# EAGLE design superbot-r1 (EAGLE 5.12)

## Sheet 1 of 2
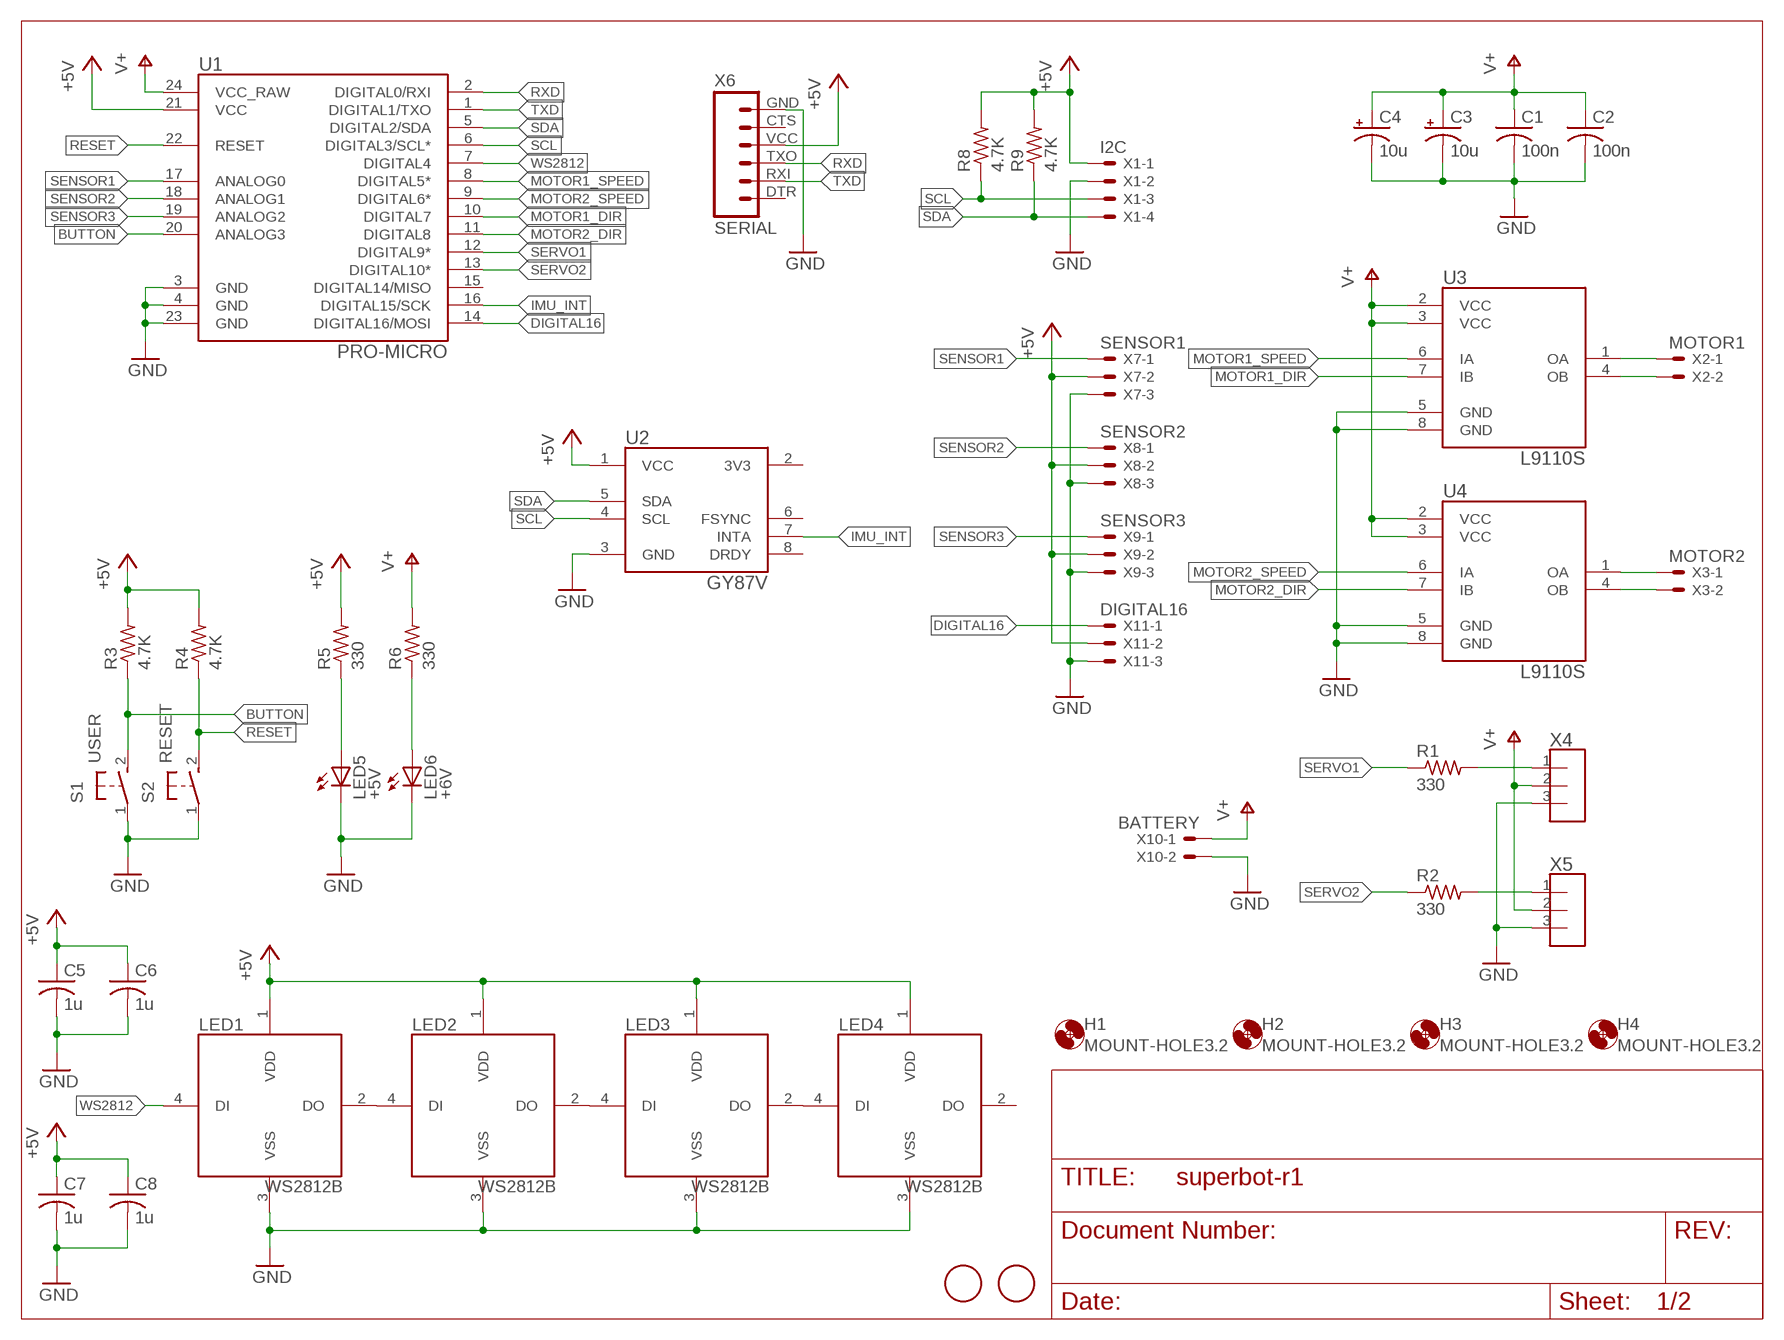
[diagram p0: schematic, sheet 1]

### Parts
C1  100n  C-USC0603  [C0603]
C2  100n  C-USC0603  [C0603]
C3  10u  CPOL-USB  [PANASONIC_B]
C4  10u  CPOL-USB  [PANASONIC_B]
C5  1u  C-USC0603  [C0603]
C6  1u  C-USC0603  [C0603]
C7  1u  C-USC0603  [C0603]
C8  1u  C-USC0603  [C0603]
H1  MOUNT-HOLE3.2  [3,2]
H2  MOUNT-HOLE3.2  [3,2]
H3  MOUNT-HOLE3.2  [3,2]
H4  MOUNT-HOLE3.2  [3,2]
LED1  WS2812B  [LED-TRICOLOR-5050-4PIN]
LED2  WS2812B  [LED-TRICOLOR-5050-4PIN]
LED3  WS2812B  [LED-TRICOLOR-5050-4PIN]
LED4  WS2812B  [LED-TRICOLOR-5050-4PIN]
LED5  +5V  LEDCHIP-LED0603  [CHIP-LED0603]
LED6  +6V  LEDCHIP-LED0603  [CHIP-LED0603]
R1  330  R-US_R0603  [R0603]
R2  330  R-US_R0603  [R0603]
R3  4.7K  R-US_R0603  [R0603]
R4  4.7K  R-US_R0603  [R0603]
R5  330  R-US_R0603  [R0603]
R6  330  R-US_R0603  [R0603]
R8  4.7K  R-US_R0603  [R0603]
R9  4.7K  R-US_R0603  [R0603]
S1  USER  TACT-SPSTSMD-6X3.6  [6X3.6-SPST]
S2  RESET  TACT-SPSTSMD-6X3.6  [6X3.6-SPST]
U1  PRO-MICRO  [PRO-MICRO]
U2  GY87V  [GY87-V]
U3  L9110S  [SO08]
U4  L9110S  [SO08]
U$3  FIDUCIAL  [FIDUCIAL_1MM]
U$4  FIDUCIAL  [FIDUCIAL_1MM]
X1  I2C  22-23-2041  [22-23-2041]
X2  MOTOR1  22-23-2021  [22-23-2021]
X3  MOTOR2  22-23-2021  [22-23-2021]
X4  M03-100MIL  [100MIL-3]
X5  M03-100MIL  [100MIL-3]
X6  SERIAL  FTDI_BASICPTH  [FTDI_BASIC]
X7  SENSOR1  22-23-2031  [22-23-2031]
X8  SENSOR2  22-23-2031  [22-23-2031]
X9  SENSOR3  22-23-2031  [22-23-2031]
X10  BATTERY  22-23-2021  [22-23-2021]
X11  DIGITAL16  22-23-2031  [22-23-2031]

### Nets
+5V: C5.1 C6.1 C7.1 C8.1 LED1.1(VDD) LED2.1(VDD) LED3.1(VDD) LED4.1(VDD) R3.2 R4.2 R5.2 R8.2 R9.2 U1.21(VCC) U2.1(VCC) X1.1 X6.VCC X7.2 X8.2 X9.2 X11.2 ; also sheet 2
BUTTON: R3.1 S1.2(S) U1.20(ANALOG3)
DIGITAL16: U1.14(DIGITAL16/MOSI) X11.1
GND: C1.2 C2.2 C3.- C4.- C5.2 C6.2 C7.2 C8.2 LED1.3(VSS) LED2.3(VSS) LED3.3(VSS) LED4.3(VSS) LED5.C LED6.C S1.1(P) S2.1(P) U1.3(GND) U1.4(GND) U1.23(GND) U2.3(GND) U3.5(GND) U3.8(GND) U4.5(GND) U4.8(GND) X1.2 X4.3 X5.3 X6.GND X7.3 X8.3 X9.3 X10.2 X11.3 ; also sheet 2
IMU_INT: U1.16(DIGITAL15/SCK) U2.7(INTA)
MOTOR1_DIR: U1.10(DIGITAL7) U3.7(IB)
MOTOR1_SPEED: U1.8(DIGITAL5*) U3.6(IA)
MOTOR2_DIR: U1.11(DIGITAL8) U4.7(IB)
MOTOR2_SPEED: U1.9(DIGITAL6*) U4.6(IA)
N$1: R1.2 X4.1
N$2: U3.1(OA) X2.1
N$3: U3.4(OB) X2.2
N$4: U4.4(OB) X3.2
N$5: U4.1(OA) X3.1
N$6: R2.2 X5.1
N$7: LED1.2(DO) LED2.4(DI)
N$8: LED2.2(DO) LED3.4(DI)
N$9: LED3.2(DO) LED4.4(DI)
N$10: LED5.A R5.1
N$11: LED6.A R6.1
RESET: R4.1 S2.2(S) U1.22(RESET)
RXD: U1.2(DIGITAL0/RXI) X6.TXO
SCL: R8.1 U1.6(DIGITAL3/SCL*) U2.4(SCL) X1.3
SDA: R9.1 U1.5(DIGITAL2/SDA) U2.5(SDA) X1.4
SENSOR1: U1.17(ANALOG0) X7.1
SENSOR2: U1.18(ANALOG1) X8.1
SENSOR3: U1.19(ANALOG2) X9.1
SERVO1: R1.1 U1.12(DIGITAL9*)
SERVO2: R2.1 U1.13(DIGITAL10*)
TXD: U1.1(DIGITAL1/TXO) X6.RXI
V+: C1.1 C2.1 C3.+ C4.+ R6.2 U1.24(VCC_RAW) U3.2(VCC) U3.3(VCC) U4.2(VCC) U4.3(VCC) X4.2 X5.2 X10.1
WS2812: LED1.4(DI) U1.7(DIGITAL4)
Unconnected: LED4.2(DO) U1.15(DIGITAL14/MISO) U2.2(3V3) U2.6(FSYNC) U2.8(DRDY) X6.CTS X6.DTR

## Sheet 2 of 2
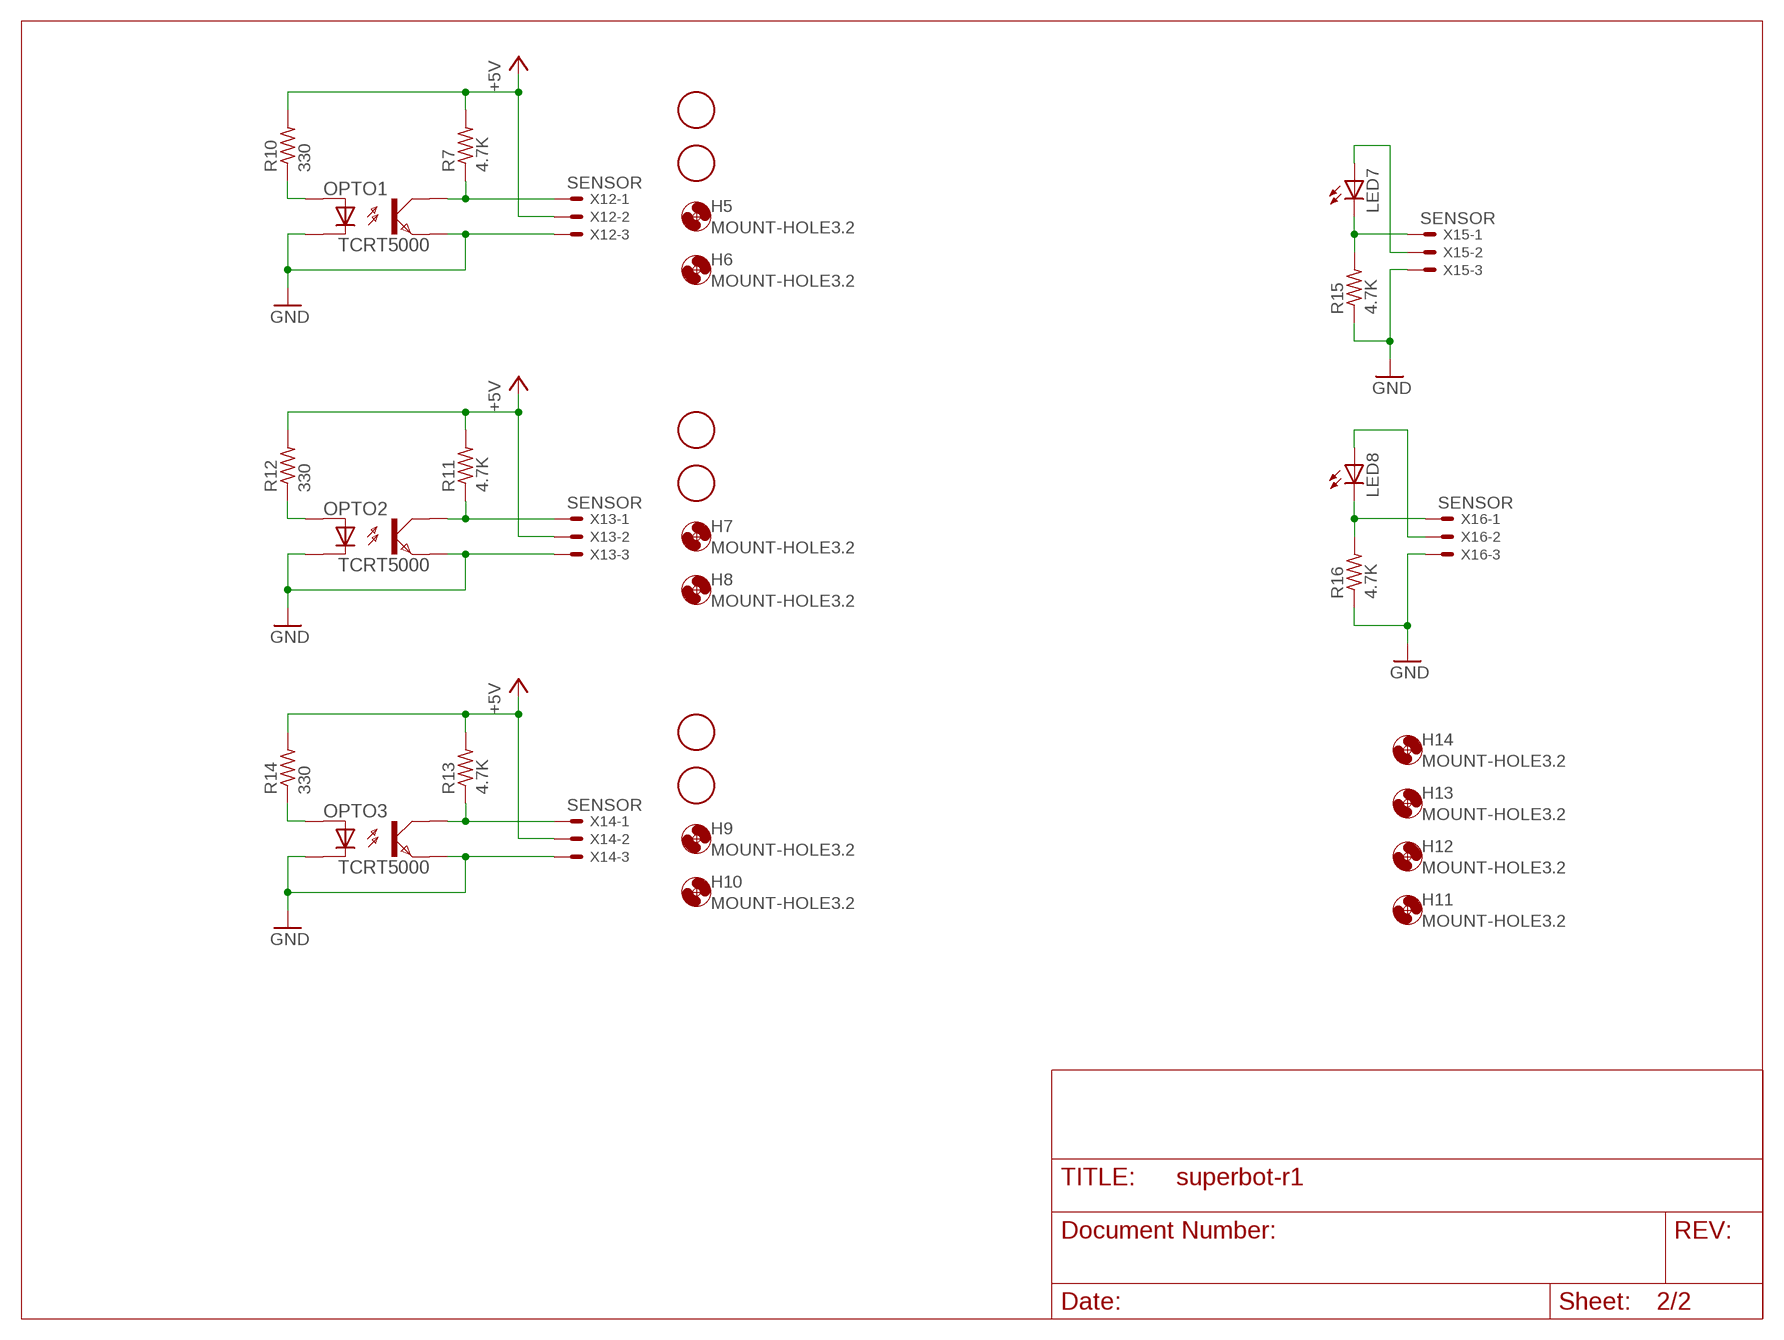
[diagram p1: schematic, sheet 2]

### Parts
H5  MOUNT-HOLE3.2  [3,2]
H6  MOUNT-HOLE3.2  [3,2]
H7  MOUNT-HOLE3.2  [3,2]
H8  MOUNT-HOLE3.2  [3,2]
H9  MOUNT-HOLE3.2  [3,2]
H10  MOUNT-HOLE3.2  [3,2]
H11  MOUNT-HOLE3.2  [3,2]
H12  MOUNT-HOLE3.2  [3,2]
H13  MOUNT-HOLE3.2  [3,2]
H14  MOUNT-HOLE3.2  [3,2]
LED7  LED3MM  [LED3MM]
LED8  LED3MM  [LED3MM]
OPTO1  TCRT5000  [TCRT5000]
OPTO2  TCRT5000  [TCRT5000]
OPTO3  TCRT5000  [TCRT5000]
R7  4.7K  R-US_R0603  [R0603]
R10  330  R-US_R0603  [R0603]
R11  4.7K  R-US_R0603  [R0603]
R12  330  R-US_R0603  [R0603]
R13  4.7K  R-US_R0603  [R0603]
R14  330  R-US_R0603  [R0603]
R15  4.7K  R-US_R0603  [R0603]
R16  4.7K  R-US_R0603  [R0603]
U$1  FIDUCIAL  [FIDUCIAL_1MM]
U$5  FIDUCIAL  [FIDUCIAL_1MM]
U$6  FIDUCIAL  [FIDUCIAL_1MM]
U$7  FIDUCIAL  [FIDUCIAL_1MM]
U$8  FIDUCIAL  [FIDUCIAL_1MM]
U$9  FIDUCIAL  [FIDUCIAL_1MM]
X12  SENSOR  22-05-7038-03  [7395-03]
X13  SENSOR  22-05-7038-03  [7395-03]
X14  SENSOR  22-05-7038-03  [7395-03]
X15  SENSOR  22-23-2031  [22-23-2031]
X16  SENSOR  22-23-2031  [22-23-2031]

### Nets
+5V: R7.2 R10.2 R11.2 R12.2 R13.2 R14.2 X12.2 X13.2 X14.2 ; also sheet 1
GND: OPTO1.CATHODE(K) OPTO1.EMITTER(E) OPTO2.CATHODE(K) OPTO2.EMITTER(E) OPTO3.CATHODE(K) OPTO3.EMITTER(E) R15.1 R16.1 X12.3 X13.3 X14.3 X15.3 X16.3 ; also sheet 1
N$12: OPTO1.ANODE(A) R10.1
N$13: OPTO1.COLLECTOR(C) R7.1 X12.1
N$14: OPTO2.ANODE(A) R12.1
N$15: OPTO2.COLLECTOR(C) R11.1 X13.1
N$16: OPTO3.ANODE(A) R14.1
N$17: OPTO3.COLLECTOR(C) R13.1 X14.1
N$18: LED7.K(C) R15.2 X15.1
N$19: LED8.K(C) R16.2 X16.1
N$20: LED8.A X16.2
N$21: LED7.A X15.2

## Library data of the parts
C1 C2 C5-C8 = rcl:C-US: CAPACITOR, American symbol
C3 C4 = rcl:CPOL-US: POLARIZED CAPACITOR, American symbol
H1-H14 = holes:MOUNT-HOLE: MOUNTING HOLE with drill center marker
LED1-LED4 = rbg-worldsemi-led:WS2812B
LED5-LED8 = led:LED: LED OSRAM: - CHIPLED LG R971, LG N971, LY N971, LG Q971, LY Q971, LO R971, LY R971 LH N974, LH R974 LS Q976, LO Q976, LY Q976 LO Q996 - Hyper CHIPLED LW Q18S LB Q993, LB Q99A, LB R99A - SideLED LS A670, LO A670, LY A670, LG A670, LP A670 LB A673, LV A673, LT A673, LW A673 LH A674 LY A675 LS A676, LA A676, LO A676, LY A676, LW A676 LS A679, LY A679, LG A679 - Hyper Micro SIDELED® LS Y876, LA Y876, LO Y876, LY Y876 LT Y87S - SmartLED LW L88C, LW L88S LB L89C, LB L89S, LG L890 LS L89K, LO L89K, LY L89K LS L896, LA L896, LO L896, LY L896 - TOPLED LS T670, LO T670, LY T670, LG T670, LP T670 LSG T670, LSP T670, LSY T670, LOP T670, LYG T670 LG T671, LOG T671, LSG T671 LB T673, LV T673, LT T673, LW T673 LH T674 LS T676, LA T676, LO T676, LY T676, LB T676, LH T676, LSB T676, LW T676 LB T67C, LV T67C, LT T67C, LS T67K, LO T67K, LY T67K, LW E67C LS E67B, LA E67B, LO E67B, LY E67B, LB E67C, LV E67C, LT E67C LW T67C LS T679, LY T679, LG T679 LS T770, LO T770, LY T770, LG T770, LP T770 LB T773, LV T773, LT T773, LW T773 LH T774 LS E675, LA E675, LY E675, LS T675 LS T776, LA T776, LO T776, LY T776, LB T776 LHGB T686 LT T68C, LB T68C - Hyper Mini TOPLED® LB M676 - Mini TOPLED Santana® LG M470 LS M47K, LO M47K, LY M47K Source: http://www.osram.convergy.de LUXEON: - LUMILED® LXK2-PW12-R00, LXK2-PW12-S00, LXK2-PW14-U00, LXK2-PW14-V00 LXK2-PM12-R00, LXK2-PM12-S00, LXK2-PM14-U00 LXK2-PE12-Q00, LXK2-PE12-R00, LXK2-PE12-S00, LXK2-PE14-T00, LXK2-PE14-U00 LXK2-PB12-K00, LXK2-PB12-L00, LXK2-PB12-M00, LXK2-PB14-N00, LXK2-PB14-P00, LXK2-PB14-Q00 LXK2-PR12-L00, LXK2-PR12-M00, LXK2-PR14-Q00, LXK2-PR14-R00 LXK2-PD12-Q00, LXK2-PD12-R00, LXK2-PD12-S00 LXK2-PH12-R00, LXK2-PH12-S00 LXK2-PL12-P00, LXK2-PL12-Q00, LXK2-PL12-R00 Source: www.luxeon.com KINGBRIGHT: KA-3528ASYC Source: www.kingbright.com
OPTO1-OPTO3 = rbg-vishay-opto:TCRT5000
R1-R16 = rcl:R-US_: RESISTOR, American symbol
S1 S2 = rbg-generic-tact-switch:TACT-SPST
U1 = rbg-sfe-modules:PRO-MICRO
U2 = rbg-gy-sensor:GY87
U3 U4 = rbg-asicnetcn-hbridge:L9110
U$1 U$3-U$9 = adafruit:FIDUCIAL: For use by pick and place machines to calibrate the vision/machine, 1mm By microbuilder.eu
X1 = con-molex:22-23-2041: .100" (2.54mm) Center Header - 4 Pin; MF: MOLEX; MPN: 22-23-2041; OC_FARNELL: 1462920; OC_NEWARK: 38C0355
X2 X3 X10 = con-molex:22-23-2021: .100" (2.54mm) Center Header - 2 Pin; MF: MOLEX; MPN: 22-23-2021; OC_FARNELL: 1462926; OC_NEWARK: 25C3832
X4 X5 = rbg-generic-headers:M03-100MIL
X6 = SparkFun:FTDI_BASIC: FTDI Basic: 3.3V and 5V
X7-X9 X11 X15 X16 = con-molex:22-23-2031: .100" (2.54mm) Center Header - 3 Pin; MF: MOLEX; MPN: 22-23-2031; OC_FARNELL: 1462950; OC_NEWARK: 30C0862
X12-X14 = con-molex:22-?-03: CONNECTOR wire to board 2.54 mm (.1 inch) pitch header; OC_FARNELL: unknown; OC_NEWARK: unknown

## Board
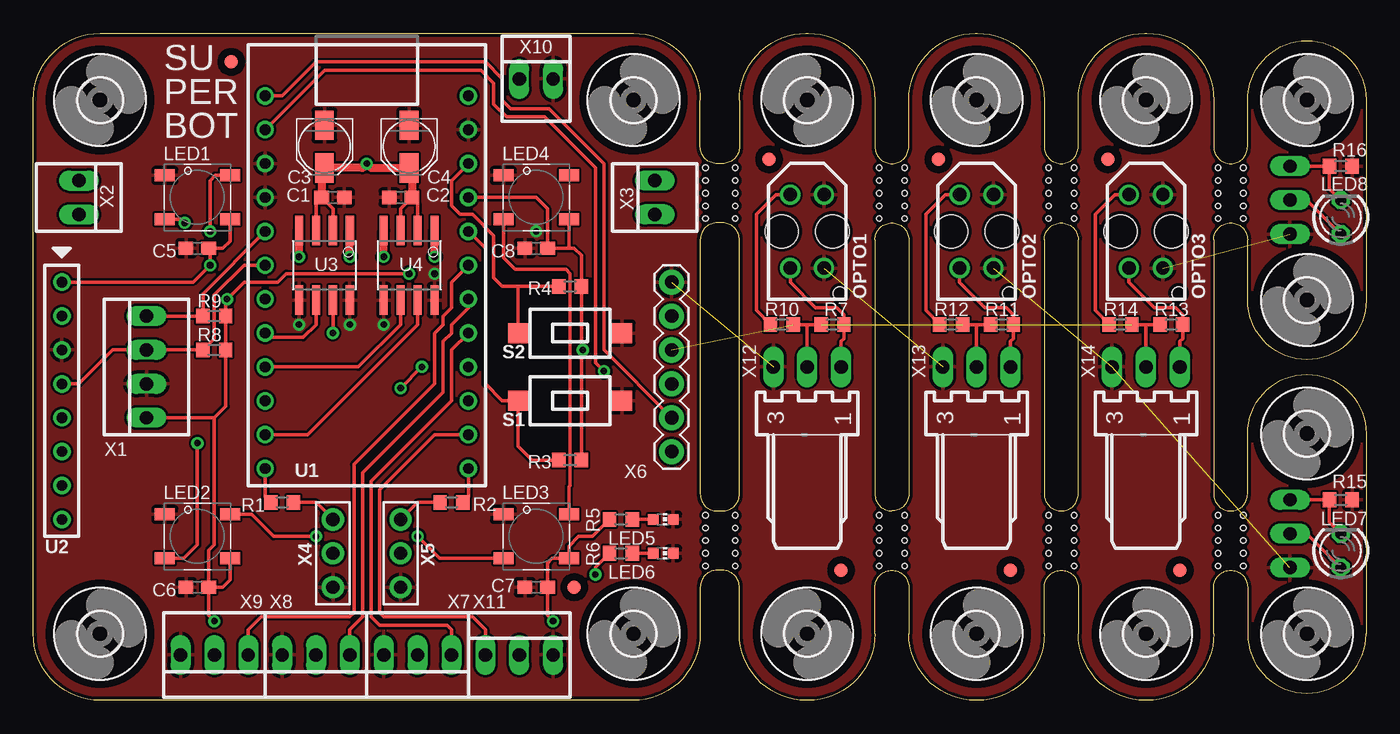
[diagram p2: board, top side]
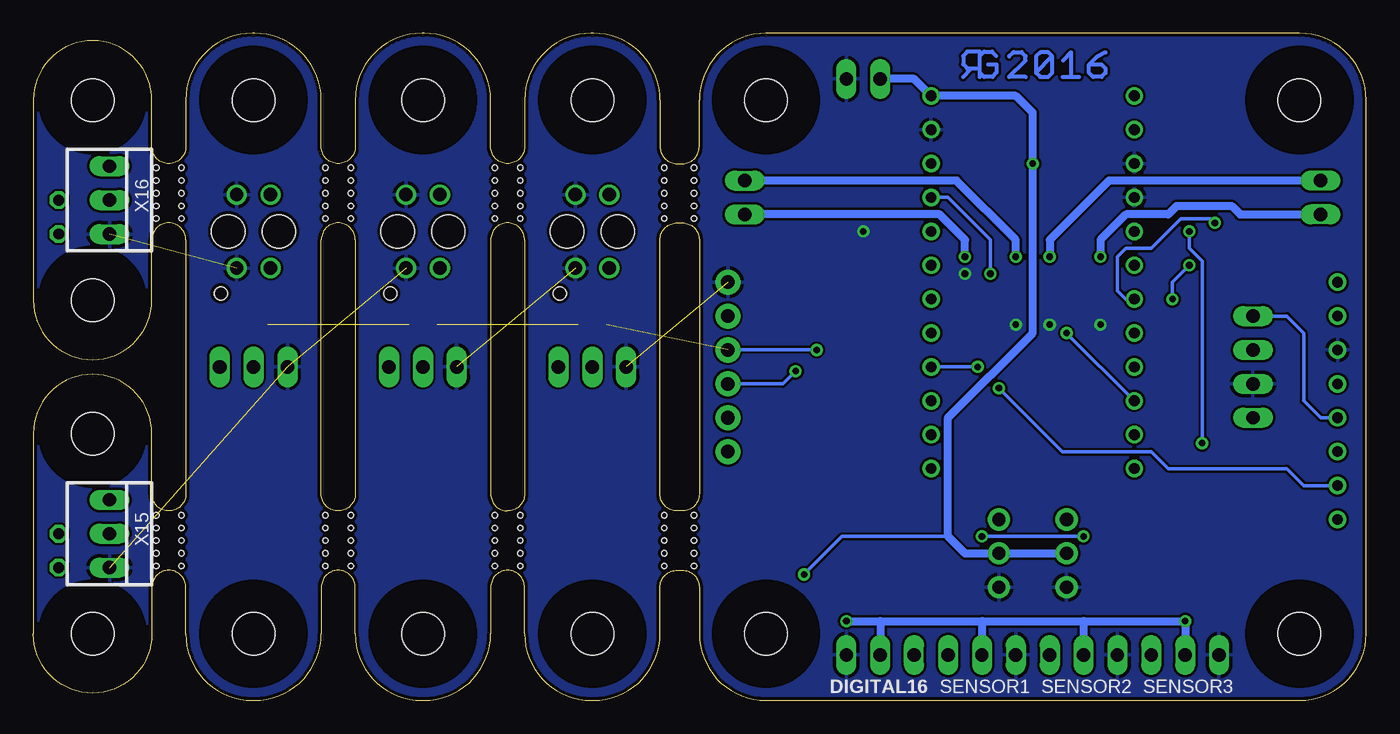
[diagram p3: board, bottom side, seen from below]

Size 99.93 x 50 mm. Coordinates in mm from the lower left corner, seen from the top.
Outline: 0,45 arc-90 5,50 45,50 arc-90 50,45 50,41.51 arc90 51.27,40.24 51.67,40.24 arc90 52.94,41.51 52.94,45 arc-90 57.94,50 58.1,50 arc-90 63.1,45 63.1,41.51 arc90 64.37,40.24 arc90 65.64,41.51 65.64,45 arc-90 70.64,50 70.8,50 arc-90 75.8,45 75.8,41.51 arc90 77.07,40.24 arc90 78.34,41.51 78.34,45 arc-90 83.34,50 83.5,50 arc-90 88.5,45 88.5,41.51 arc90 89.77,40.24 arc90 91.04,41.51 91.04,45 arc-90 95.49,49.45 arc-90 99.93,45.01 99.93,29.99 arc-90 95.49,25.55 arc-90 91.04,30 91.04,34.52 arc90 89.77,35.8 arc90 88.5,34.52 88.5,15.47 arc90 89.77,14.21 arc90 91.04,15.47 91.04,20 arc-90 95.49,24.45 arc-90 99.93,20.01 99.93,4.99 arc-90 95.49,0.55 arc-90 91.04,5 91.04,8.49 arc90 89.77,9.76 arc90 88.5,8.49 88.5,5 arc-90 83.5,0 83.34,0 arc-90 78.34,5 78.34,8.49 arc90 77.07,9.76 arc90 75.8,8.49 75.8,5 arc-90 70.8,0 70.64,0 arc-90 65.64,5 65.64,8.49 arc90 64.37,9.76 arc90 63.1,8.49 63.1,5 arc-90 58.1,0 57.94,0 arc-90 52.94,5 52.94,8.49 arc90 51.67,9.76 51.27,9.76 arc90 50,8.49 50,5 arc-90 45,0 5,0 arc-90 0,5 0,45
Outline: 63.1,34.52 arc-90 64.37,35.8 arc-90 65.64,34.52 65.64,15.47 arc-90 64.37,14.21 arc-90 63.1,15.47 63.1,34.52
Outline: 75.8,34.52 arc-90 77.07,35.8 arc-90 78.34,34.52 78.34,15.47 arc-90 77.07,14.21 arc-90 75.8,15.47 75.8,34.52
Outline: 50,15.47 arc90 51.27,14.21 51.67,14.21 arc90 52.94,15.47 52.94,34.52 arc90 51.67,35.8 51.27,35.8 arc90 50,34.52 50,15.47
Copper layers (1*16): Top 0.035mm / dielectric 1.5mm / Bottom 0.035mm
Design rules "default *": minimum track width 10mil, minimum drill 0.5mm, track to track 7mil, track to pad 7mil, pad to pad 7mil, via to via 7mil, smd to smd 7mil, copper to edge 10mil, drill to drill 8mil, minimum pad ring 10mil, minimum via ring 8mil, stop-mask expansion 4mil, vias tented up to drill 20mil, thermal gap 10mil
Holes 0.4 mm at 65.32,39.92 65.32,38.97 65.32,38.02 65.32,37.06 63.42,39.92 63.42,38.97 63.42,38.02 63.42,37.06 63.42,36.11 65.32,36.11 78.02,39.92 78.02,38.97 78.02,38.02 78.02,37.06 76.12,39.92 76.12,38.97 76.12,38.02 76.12,37.06 76.12,36.11 78.02,36.11 65.32,13.89 65.32,12.94 65.32,11.98 65.32,11.03 63.42,13.89 63.42,12.94 63.42,11.98 63.42,11.03 63.42,10.08 65.32,10.08 78.02,13.89 78.02,12.94 78.02,11.98 78.02,11.03 76.12,13.89 76.12,12.94 76.12,11.98 76.12,11.03 76.12,10.08 78.02,10.08 52.62,39.92 52.62,38.97 52.62,38.02 52.62,37.06 50.4,39.92 50.4,38.97 50.4,38.02 50.4,37.06 50.4,36.11 52.62,36.11 52.62,13.89 52.62,12.94 52.62,11.98 52.62,11.03 50.4,13.89 50.4,12.94 50.4,11.98 50.4,11.03 50.4,10.08 52.62,10.08 90.72,13.89 90.72,12.94 90.72,11.98 90.72,11.03 88.82,13.89 88.82,12.94 88.82,11.98 88.82,11.03 88.82,10.08 90.72,10.08 90.72,39.92 90.72,38.97 90.72,38.02 90.72,37.06 88.82,39.92 88.82,38.97 88.82,38.02 88.82,37.06 88.82,36.11 90.72,36.11

### Footprints (pad centres in the part's own frame; a part is rotated, then mirrored left to right if it is on the bottom)
C0603 = smd 1.1 x 1: 1 -0.85,0; 2 0.85,0
PANASONIC_B = smd 2.2 x 1.4: + 1.6,0; - -1.6,0
3,2 = hole 3.2: 0,0
LED-TRICOLOR-5050-4PIN = smd 1.5 x 0.9: 1 2.45,-1.65; 2 2.45,1.65; 3 -2.45,1.65; 4 -2.45,-1.65
CHIP-LED0603 = smd 0.8 x 0.8: A 0,-0.75; C 0,0.75
LED3MM = drill 0.813 octagon: A -1.27,0; K 1.27,0
TCRT5000 = drill 1 round: ANODE 2.75,1.27; CATHODE 2.75,-1.27; COLLECTOR -2.75,1.27; EMITTER -2.75,-1.27 | hole 1: -4.65,-2.45 | hole 2.5: 0,-1.9; 0,1.9
R0603 = smd 1 x 1.1: 1 -0.85,0; 2 0.85,0
6X3.6-SPST = smd 1.5 x 1.5: 1 -3.9,0; 2 3.9,0
PRO-MICRO = drill 0.8 round: 1 -7.62,12.7; 2 -7.62,10.16; 3 -7.62,7.62; 4 -7.62,5.08; 5 -7.62,2.54; 6 -7.62,0; 7 -7.62,-2.54; 8 -7.62,-5.08; 9 -7.62,-7.62; 10 -7.62,-10.16; 11 -7.62,-12.7; 12 -7.62,-15.24; 13 7.62,-15.24; 14 7.62,-12.7; 15 7.62,-10.16; 16 7.62,-7.62; 17 7.62,-5.08; 18 7.62,-2.54; 19 7.62,0; 20 7.62,2.54; 21 7.62,5.08; 22 7.62,7.62; 23 7.62,10.16; 24 7.62,12.7
GY87-V = drill 0.8 round: 1 0,8.89; 2 0,6.35; 3 0,3.81; 4 0,1.27; 5 0,-1.27; 6 0,-3.81; 7 0,-6.35; 8 0,-8.89
SO08 = smd 0.61 x 2.21: 1 -1.905,-2.616; 2 -0.635,-2.616; 3 0.635,-2.616; 4 1.905,-2.616; 5 1.905,2.616; 6 0.635,2.616; 7 -0.635,2.616; 8 -1.905,2.616
FIDUCIAL_1MM = smd 1 x 1: 1 0,0
22-23-2041 = drill 1 long: 1 -3.81,0; 2 -1.27,0; 3 1.27,0; 4 3.81,0
22-23-2021 = drill 1 long: 1 -1.27,0; 2 1.27,0
100MIL-3 = drill 1 pad 1.676 round: 1 -2.54,0; 2 0,0; 3 2.54,0
FTDI_BASIC = drill 1.016 pad 1.88 round: CTS 10.16,0; DTR 0,0; GND 12.7,0; RXI 2.54,0; TXO 5.08,0; VCC 7.62,0
22-23-2031 = drill 1 long: 1 -2.54,0; 2 0,0; 3 2.54,0
7395-03 = drill 1.016 long: 1 2.54,0; 2 0,0; 3 -2.54,0

### Placement (x,y rotation side)
C1  22.46,37.7 0 top
C2  27.54,37.7 180 top
C3  21.82,41.51 270 top
C4  28.18,41.51 270 top
C5  12.3,33.89 180 top
C6  12.3,8.49 180 top
C7  37.7,8.49 180 top
C8  37.7,33.89 180 top
H1  5,5 0 top
H2  5,45 0 top
H3  45,45 0 top
H4  45,5 0 top
H5  58.02,45 90 top
H6  58.02,5 90 top
H7  70.72,45 0 top
H8  70.72,5 0 top
H9  83.42,5 0 top
H10  83.42,45 0 top
H11  95.48,5 0 top
H12  95.48,45 0 top
H13  95.48,20 0 top
H14  95.48,30 0 top
LED1  12.3,37.7 0 top
LED2  12.3,12.3 0 top
LED3  37.7,12.3 0 top
LED4  37.7,37.7 0 top
LED5  47.23,13.57 270 top
LED6  47.23,11.03 270 top
LED7  98.03,11.23 90 top
LED8  98.03,36.23 90 top
OPTO1  58.02,35.16 90 top
OPTO2  70.72,35.16 90 top
OPTO3  83.42,35.16 90 top
R1  18.65,14.84 0 top
R2  31.35,14.84 180 top
R3  40.24,18.02 0 top
R4  40.24,31.03 0 top
R5  44.05,13.57 180 top
R6  44.05,11.03 180 top
R7  59.92,28.18 180 top
R8  13.57,26.27 0 top
R9  13.57,28.81 0 top
R10  56.11,28.18 0 top
R11  72.62,28.18 180 top
R12  68.81,28.18 0 top
R13  85.33,28.18 180 top
R14  81.52,28.18 0 top
R15  98.03,15.04 180 top
R16  98.03,40.04 180 top
S1  40.24,22.46 180 top
S2  40.24,27.54 180 top
U1  25,32.62 0 top
U2  2.14,22.46 0 top
U3  21.82,32.62 180 top
U4  28.18,32.62 180 top
U$1  55.16,40.56 90 top
U$2  [RGLOGO_SMALL_2016]  28.81,46.59 0 bottom
U$3  40.56,8.49 0 top
U$4  14.84,47.86 0 top
U$5  60.56,9.76 0 top
U$6  67.86,40.56 0 top
U$7  73.26,9.76 0 top
U$8  80.56,40.56 0 top
U$9  85.96,9.76 0 top
X1  8.49,25 90 top
X2  3.41,37.7 270 top
X3  46.59,37.7 90 top
X4  22.46,11.03 270 top
X5  27.54,11.03 270 top
X6  47.86,18.65 90 top
X7  28.81,3.41 180 top
X8  21.19,3.41 180 top
X9  13.57,3.41 180 top
X10  37.7,46.59 0 top
X11  36.43,3.41 0 top
X12  58.02,25 0 top
X13  70.72,25 0 top
X14  83.42,25 0 top
X15  94.22,12.5 270 bottom
X16  94.22,37.5 270 bottom

### Tracks (layer width: path | path; a pad name or v marks a point on that pad's centre or on a via)
+5V  (via drill 0.5)  (3 unrouted)
  Top 0.254: C6.1 13.15,6.37 v13.57,5.95 | LED2.1 14.75,9.04 14.21,8.49 C6.1 | v38.97,5.95 38.55,6.37 C7.1 38.55,10.29 38.91,10.65 LED3.1 40.15,11.57 40.88,12.3 41.93,12.3 R5.2 | LED1.1 14.75,34.44 14.21,33.89 C5.1 13.25,33.79 v13.25,32.62 11.98,31.35 U2.1 | 13.57,21.19 14.42,22.04 R8.2 R9.2 14.42,29.98 v14.52,30.08 15.79,31.35 18.33,31.35 18.97,31.98 v28.18,31.98 | 13.57,21.19 X1.1 | U1.21 37.7,37.7 38.55,36.85 C8.1 40.24,33.89 | 13.57,21.19 13.57,11.66 13.15,11.24 C6.1 | R3.2 41.09,26.17 v41.19,26.27 41.09,26.37 R4.2 41.09,33.36 40.56,33.89 40.24,33.89 | LED4.1 40.15,33.98 40.24,33.89 | X12.2 58.02,28.18 | 58.02,28.18 R7.2 | 58.02,28.18 R10.2 | 70.72,28.18 R12.2 | 70.72,28.18 R11.2 | 83.42,28.18 R14.2 | 83.42,28.18 R13.2 | X14.2 83.42,28.18 | X13.2 70.72,28.18
  Bottom 0.254: v14.52,30.08 14.52,31.35 v13.25,32.62 | U1.21 31.35,37.7 28.18,34.52 v28.18,31.98 | v41.19,26.27 X6.VCC
  Bottom 0.61: X9.2 v13.57,5.95 21.19,5.95 | 28.81,5.95 21.19,5.95 | 28.81,5.95 X7.2 | 21.19,5.95 X8.2 | v38.97,5.95 36.43,5.95 | 36.43,5.95 28.81,5.95 | 36.43,5.95 X11.2
BUTTON
  Top 0.254: R3.1 37.38,18.02 36.34,19.06 S1.2 35.16,22.46 33.89,23.73 33.89,33.89 U1.20
DIGITAL16
  Top 0.254: X11.1 33.89,5.32 32.94,6.27 26.27,6.27 25.95,6.59 25.95,15.79 30.08,19.92 U1.14
GND  (via drill 0.5)  (5 unrouted)
  other vias: 19.92,28.18 23.73,28.18 26.27,28.18 30.08,31.98 37.7,35.16
  pour Top: -0.4,50.4 50.4,50.4 50.4,-0.4 -0.4,-0.4
  pour Bottom: -0.4,50.4 50.4,50.4 50.4,-0.4 -0.4,-0.4
  pour Top: 52.94,50.4 63.1,50.4 63.1,-0.4 52.94,-0.4
  pour Bottom: 52.94,50.4 63.1,50.4 63.1,-0.4 52.94,-0.4
  pour Bottom: 65.64,50.4 75.8,50.4 75.8,-0.4 65.64,-0.4
  pour Bottom: 78.34,50.4 88.5,50.4 88.5,-0.4 78.34,-0.4
  pour Top: 65.64,50.4 75.8,50.4 75.8,-0.4 65.64,-0.4
  pour Top: 78.34,50.4 88.5,50.4 88.5,-0.4 78.34,-0.4
  pour Top: 91.04,49.45 99.93,49.45 99.93,0.55 91.04,0.55
  pour Bottom: 91.04,49.45 99.93,49.45 99.93,0.55 91.04,0.55
IMU_INT  (via drill 0.5)
  Top 0.254: v29.13,25 v27.54,23.41
  Bottom 0.254: U2.7 4.68,16.11 5.95,17.38 14.84,17.38 16.11,18.65 22.78,18.65 v27.54,23.41 | v29.13,25 U1.16
MOTOR1_DIR  (via drill 0.5)
  Top 0.254: U3.7 v22.46,27.54
  Bottom 0.254: v22.46,27.54 U1.10
MOTOR1_SPEED
  Top 0.254: U3.6 21.19,28.18 20.24,27.22 17.7,27.22 U1.8
MOTOR2_DIR
  Top 0.254: U1.11 20.55,19.92 28.81,28.18 U4.7
MOTOR2_SPEED
  Top 0.254: U1.9 24.36,25 27.54,28.18 U4.6
N$1
  Top 0.254: X4.1 21.19,14.84 R1.2
N$2  (via drill 0.5)
  Top 0.61: v23.73,33.26 U3.1
  Bottom 0.61: X2.1 19.29,38.97 23.73,34.52 v23.73,33.26
N$3  (via drill 0.5)
  Top 0.61: v19.92,33.26 U3.4
  Bottom 0.61: X2.2 9.44,36.43 10.08,37.06 14.21,37.06 14.84,36.43 18.02,36.43 19.92,34.52 v19.92,33.26
N$4  (via drill 0.5)
  Top 0.61: v26.27,33.26 U4.4
  Bottom 0.61: X3.2 30.71,38.97 26.27,34.52 v26.27,33.26
N$5  (via drill 0.5)
  Top 0.61: v30.08,33.26 U4.1
  Bottom 0.61: X3.1 31.98,36.43 30.08,34.52 v30.08,33.26
N$6
  Top 0.254: X5.1 28.81,14.84 R2.2
N$7  (via drill 0.5)
  Top 0.254: LED1.2 13.63,39.35 13.25,38.97 v13.25,35.16 | v12.3,19.29 12.3,12.3 12.3,11.66 11.29,10.65 LED2.4
  Bottom 0.254: v13.25,35.16 13.25,33.89 12.3,32.94 v12.3,19.29
N$8  (via drill 0.5)
  Top 0.254: LED3.4 30.46,10.65 v28.81,12.3 | v21.19,12.3 18.02,12.3 16.37,13.95 LED2.2
  Bottom 0.254: v28.81,12.3 v21.19,12.3
N$9
  Top 0.254: LED4.4 35.25,33.16 36.11,32.3 39.92,32.3 40.24,31.98 40.24,16.11 40.15,16.02 LED3.2
N$10
  Top 0.254: R5.1 LED5.A
N$11
  Top 0.254: R6.1 LED6.A
N$12
  Top 0.254: OPTO1.ANODE 55.69,37.91 54.21,36.43 54.21,29.23 R10.1
N$13
  Top 0.254: OPTO1.COLLECTOR 56.75,31.35 58.66,29.45 60.24,29.45 60.77,28.91 R7.1 60.77,27.12 60.56,26.91 X12.1
N$14
  Top 0.254: OPTO2.ANODE 68.39,37.91 66.91,36.43 66.91,29.23 R12.1
N$15
  Top 0.254: X13.1 73.26,26.91 73.47,27.12 R11.1 73.47,28.91 72.94,29.45 71.35,29.45 69.45,31.35 OPTO2.COLLECTOR
N$16
  Top 0.254: OPTO3.ANODE 81.09,37.91 79.61,36.43 79.61,29.23 R14.1
N$17
  Top 0.254: X14.1 85.96,26.91 86.17,27.12 R13.1 86.17,28.91 85.64,29.45 84.06,29.45 82.15,31.35 OPTO3.COLLECTOR
N$18
  Top 0.254: X15.1 R15.2 97.17,13.35 LED7.K
N$19
  Top 0.254: X16.1 R16.2 97.17,38.35 LED8.K
N$20
  Top 0.254: X16.2 95.48,37.5 LED8.A
N$21
  Top 0.254: X15.2 95.48,12.5 LED7.A
RESET
  Top 0.254: U1.22 31.35,38.97 31.35,37.06 31.98,36.43 32.94,36.43 34.52,34.84 34.52,31.67 35.16,31.03 36.43,31.03 | 36.43,31.03 R4.1 | S2.2 36.34,30.94 36.43,31.03
RXD  (via drill 0.5)
  Top 0.254: U1.2 21.82,47.23 33.57,47.23 34.52,46.27 34.52,44.69 35.48,43.73 38.34,43.73 42.14,39.92 42.14,25.32 v42.78,24.68
  Bottom 0.254: v42.78,24.68 43.73,23.73 X6.TXO
SCL
  Top 0.254: U1.6 15.79,32.62 13.57,30.4 13.57,27.12 R8.1 X1.3 5.95,26.27 3.41,23.73 U2.4
SDA
  Top 0.254: X1.4 R9.1 12.72,30.5 U1.5
  Bottom 0.254: X1.4 5.95,28.81 4.68,27.54 4.68,22.46 3.41,21.19 U2.5
SENSOR1
  Top 0.254: X7.1 31.35,5.32 31.03,5.63 25.95,5.63 25.32,6.27 25.32,16.43 31.35,22.46 31.35,26.27 U1.17
SENSOR2
  Top 0.254: U1.18 32.62,29.45 31.35,28.18 31.35,27.54 30.71,26.91 30.71,23.09 24.68,17.06 24.68,6.27 23.73,5.32 X8.1
SENSOR3
  Top 0.254: U1.19 31.35,31.35 31.35,29.45 30.71,28.81 30.71,28.18 30.08,27.54 30.08,23.73 24.05,17.7 24.05,6.59 23.73,6.27 17.06,6.27 16.11,5.32 X9.1
SERVO1
  Top 0.254: U1.12 17.38,15.26 R1.1
SERVO2
  Top 0.254: U1.13 32.62,15.26 R2.1
TXD
  Top 0.254: U1.1 18.65,45.32 21.19,47.86 33.89,47.86 35.16,46.59 35.16,45 35.8,44.37 38.65,44.37 42.78,40.24 42.78,26.27 X6.RXI
V+  (via drill 0.5)
  Top 0.254: U3.3 21.19,37.28 C1.1 22.46,36.85 U3.2 | U4.2 28.81,37.28 C2.1 27.54,36.85 U4.3 | R6.2 42.14,9.97 v42.14,9.44
  Top 0.61: C1.1 21.61,39.7 C3.+ 24.67,39.91 v25,40.24 25.33,39.91 C4.+ 28.39,39.7 C2.1
  Bottom 0.254: v42.14,9.44 39.29,12.3 31.35,12.3
  Bottom 0.61: X10.1 33.89,46.59 U1.24 26.27,45.32 25,44.05 v25,40.24 25,27.54 31.35,21.19 31.35,12.3 30.08,11.03 X5.2 X4.2
WS2812  (via drill 0.5)
  Top 0.254: LED1.4 11.09,36.05 v11.35,35.8
  Bottom 0.254: v11.35,35.8 11.66,36.11 13.89,36.11 16.11,33.89 18.02,33.89 18.65,33.26 18.65,30.71 18.02,30.08 U1.7

### Text on the board
tNames: SU | PER | BOT
bNames: SENSOR3 | SENSOR2 | SENSOR1 | DIGITAL16